# Altium project Scooter - Secondary Board - Project.PrjPCB
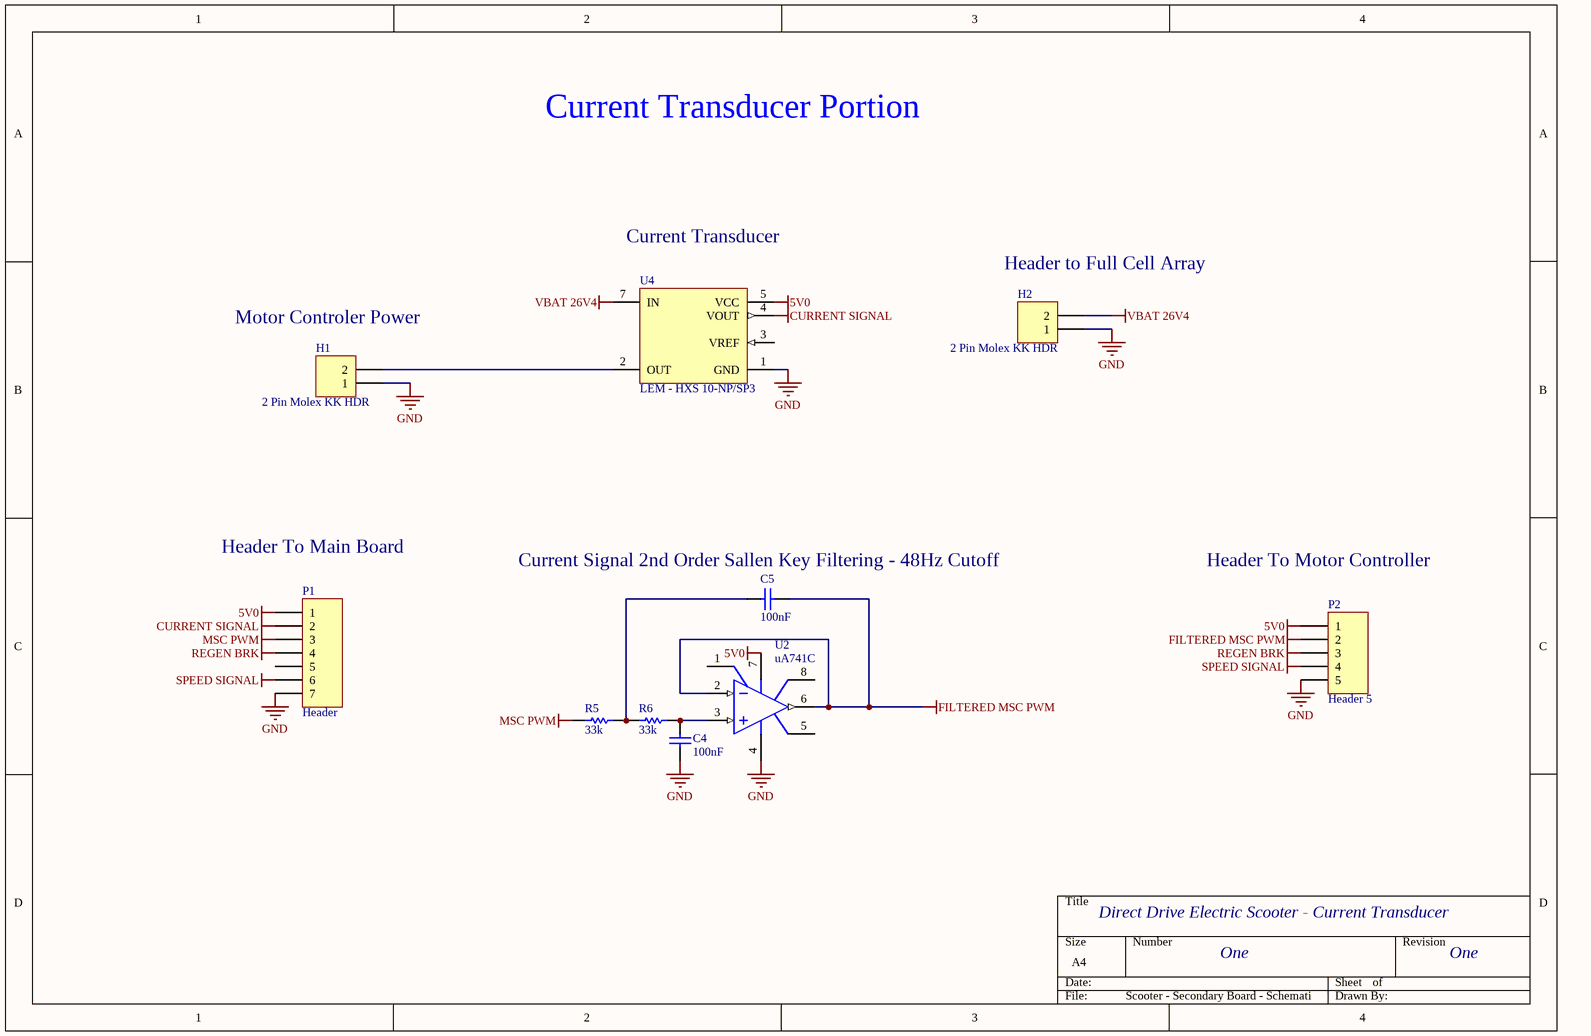
[diagram p0: Scooter - Secondary Board - Schematic.SchDoc]
1 sheet, 10 parts. Net scope: global (net labels, ports and power ports of the same name join across sheets).
Board file: Scooter - Secondary Board - PCB Layout.PcbDoc

## Sheet Scooter - Secondary Board - Schematic.SchDoc: Direct Drive Electric Scooter - VeroBoard Portion
size A4

### Parts
C4  100nF  [CAPC1608L]
C5  100nF  [CAPC1608L]
H1  2 Pin Molex KK HDR  [MOLEX_KK_2_HDR]
H2  2 Pin Molex KK HDR  [MOLEX_KK_2_HDR]
P1  Header  [HDR1X7]
P2  Header 5  [HDR1X5]
R5  33k  [RESC1608L]
R6  33k  [RESC1608L]
U2  uA741C  [SO8_N]
U4  LEM - HXS 10-NP/SP3  [PCBComponent_1]

### Nets
5V0: P1.1 P2.1 U2.7(V+) U4.5(VCC)
CURRENT SIGNAL: P1.2 U4.4(VOUT)
FILTERED MSC PWM: C5.1 P2.2 U2.2(IN-) U2.6(OUT)
GND: C4.1 H1.1 H2.1 P1.7 P2.5 U2.4(V-) U4.1(GND)
MSC PWM: P1.3 R5.2
REGEN BRK: P1.4 P2.3
SPEED SIGNAL: P1.6 P2.4
VBAT 26V4: H2.2 U4.7(IN)
NetC4_2: C4.2 R6.1 U2.3(IN+)
NetC5_2: C5.2 R5.1 R6.2
NetH1_2: H1.2 U4.2(OUT)

Not connected (* = marked no-connect by the designer): P1 5; U2 1(BAL1/CMPEN) 5(BAL2) 8(CMPEN); U4 3(VREF)

### Notes on the sheet
- Current Transducer Portion
- Current Transducer
- (near H2) Header to Full Cell Array
- (near H1) Motor Controler Power
- Header To Main Board
- (near C5) Current Signal 2nd Order Sallen Key Filtering - 48Hz Cutoff
- Header To Motor Controller
- Direct Drive Electric Scooter - Current Transducer
- One

### Library data of the parts
C4 C5 = CC_100nF_0603: CAP CER 100nF X7R +-10% 50V 0603; PackageReference: 0603; Code_IPC: 1608 [0603]; Verify: *; Supplier: ECE Dept Stock; Storage Location: Pottle; Value: 100nF
H1 H2 = JA_MOLEX_KK_2POS: CONN HEADER 2POS 2.54mm VERT_Thru Hole; Supplier 1: Farnell; Supplier Part Number 1: 1462926; Supplier 2: ECE Store; Value: 2 Pin Molex KK HDR
P1 = Header 7: Header, 7-Pin; LatestRevisionDate: 17-Jul-2002; LatestRevisionNote: Re-released for DXP Platform.; Publisher: Altium Limited
P2 = Header 5: Header, 5-Pin; LatestRevisionDate: 17-Jul-2002; LatestRevisionNote: Re-released for DXP Platform.; Publisher: Altium Limited
R5 R6 = RS_10K: RES 10.0K OHM 1/10W 5% 0603 SMD; Storage Location: ProtoPlace; Supplier: ECE Dept Stock; Value: 33k
U2 = LM101AJG: High Performance Operational Amplifier; ComponentAvailability: Obsolete; Published: 16-Jan-2001; LatestRevisionDate: 04-Mar-2005; LatestRevisionNote: Stylized 3D Model Added.; DatasheetVersion: Sep-1990; PackageVersion: Jan-1995; PackageReference: JG008; Publisher: Altium Limited; PackageDescription: DIP; 8 Leads; Row Spacing 7.62 mm; Pitch 2.54 mm; ComponentLink1Description: Manufacturer Link; ComponentLink1URL: http://www.ti.com/; ComponentLink2Description: Datasheet; ComponentLink2URL: http://focus.ti.com/lit/ds/slos061/slos061.pdf; ComponentLink3Description: Discontinuation Notice; ComponentLink3URL: http://focus.ti.com/pdfs/mltry/obsolete.pdf
U4 = TC1072-3.0VCH713: 50mA and 100mA CMOS LDOs with Shutdown, Active-Low Error Output and VREF Bypass, 6-Pin SOT-23, Extended Temperature, Tape and Reel; Published: 29-Jan-2009; DatasheetVersion: revD, Feb-2007; PackageVersion: revBB, Aug-2009; PackageReference: SOT-23-CH6; Publisher: Altium Limited; PackageDescription: 6-Lead Plastic Small Outline Transistor (CH) [SOT-23]; Supplier 1: Digi-Key; Supplier Part Number 1: TC1072-3.0VCH713-ND; Code_IPC: SOT26A-6; ComponentLink1Description: Datasheet; ComponentLink1URL: http://ww1.microchip.com/downloads/en/DeviceDoc/21354d.pdf; ComponentLink2Description: Packaging Specification; ComponentLink2URL: http://www.microchip.com/stellent/groups/techpub_sg/documents/packagingspec/en012702.pdf; ComponentLink3Description: Microchip.com Home; ComponentLink3URL: http://www.microchip.com/